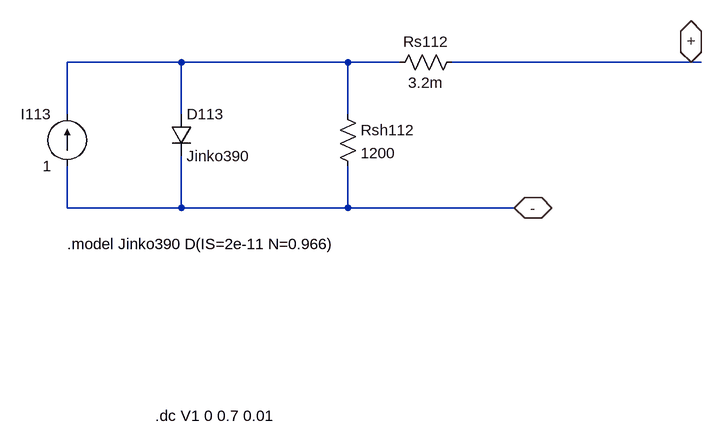
[diagram p0: schematic 24_09_10_Bomen_Cell_Shaded.asc]
24_09_10_Bomen_Cell_Shaded.asc, the LTspice schematic file:
Version 4.1
SHEET 1 9108 680
WIRE -2000 48 -2176 48
WIRE -1744 48 -2000 48
WIRE -1664 48 -1744 48
WIRE -1216 48 -1584 48
WIRE -1200 48 -1216 48
WIRE -2176 128 -2176 48
WIRE -2000 128 -2000 48
WIRE -1744 128 -1744 48
WIRE -2176 272 -2176 208
WIRE -2000 272 -2000 192
WIRE -2000 272 -2176 272
WIRE -1744 272 -1744 208
WIRE -1744 272 -2000 272
WIRE -1488 272 -1744 272
FLAG -1488 272 -
IOPIN -1488 272 BiDir
FLAG -1216 48 +
IOPIN -1216 48 BiDir
SYMBOL diode -2016 128 R0
SYMATTR InstName D113
SYMATTR Value Jinko390
SYMBOL current -2176 208 R180
WINDOW 0 24 80 Left 2
WINDOW 3 24 0 Left 2
WINDOW 123 0 0 Left 0
WINDOW 39 0 0 Left 0
SYMATTR InstName I113
SYMATTR Value 1
SYMBOL res -1760 112 R0
SYMATTR InstName Rsh112
SYMATTR Value 1200
SYMBOL res -1680 64 R270
WINDOW 0 32 56 VTop 2
WINDOW 3 0 56 VBottom 2
SYMATTR InstName Rs112
SYMATTR Value 3.2m
TEXT -2176 328 Left 2 !.model Jinko390 D(IS=2e-11 N=0.966)
TEXT -2040 592 Left 2 !.dc V1 0 0.7 0.01

The netlist it stands for:
* 24_09_10_Bomen_Cell_Shaded.asc
D113 N001 - Jinko390
I113 - N001 1
Rsh112 N001 - 1200
Rs112 N001 + 3.2m
.model D D
.lib standard.dio
.model Jinko390 D(IS=2e-11 N=0.966)
.dc V1 0 0.7 0.01
.backanno
.end